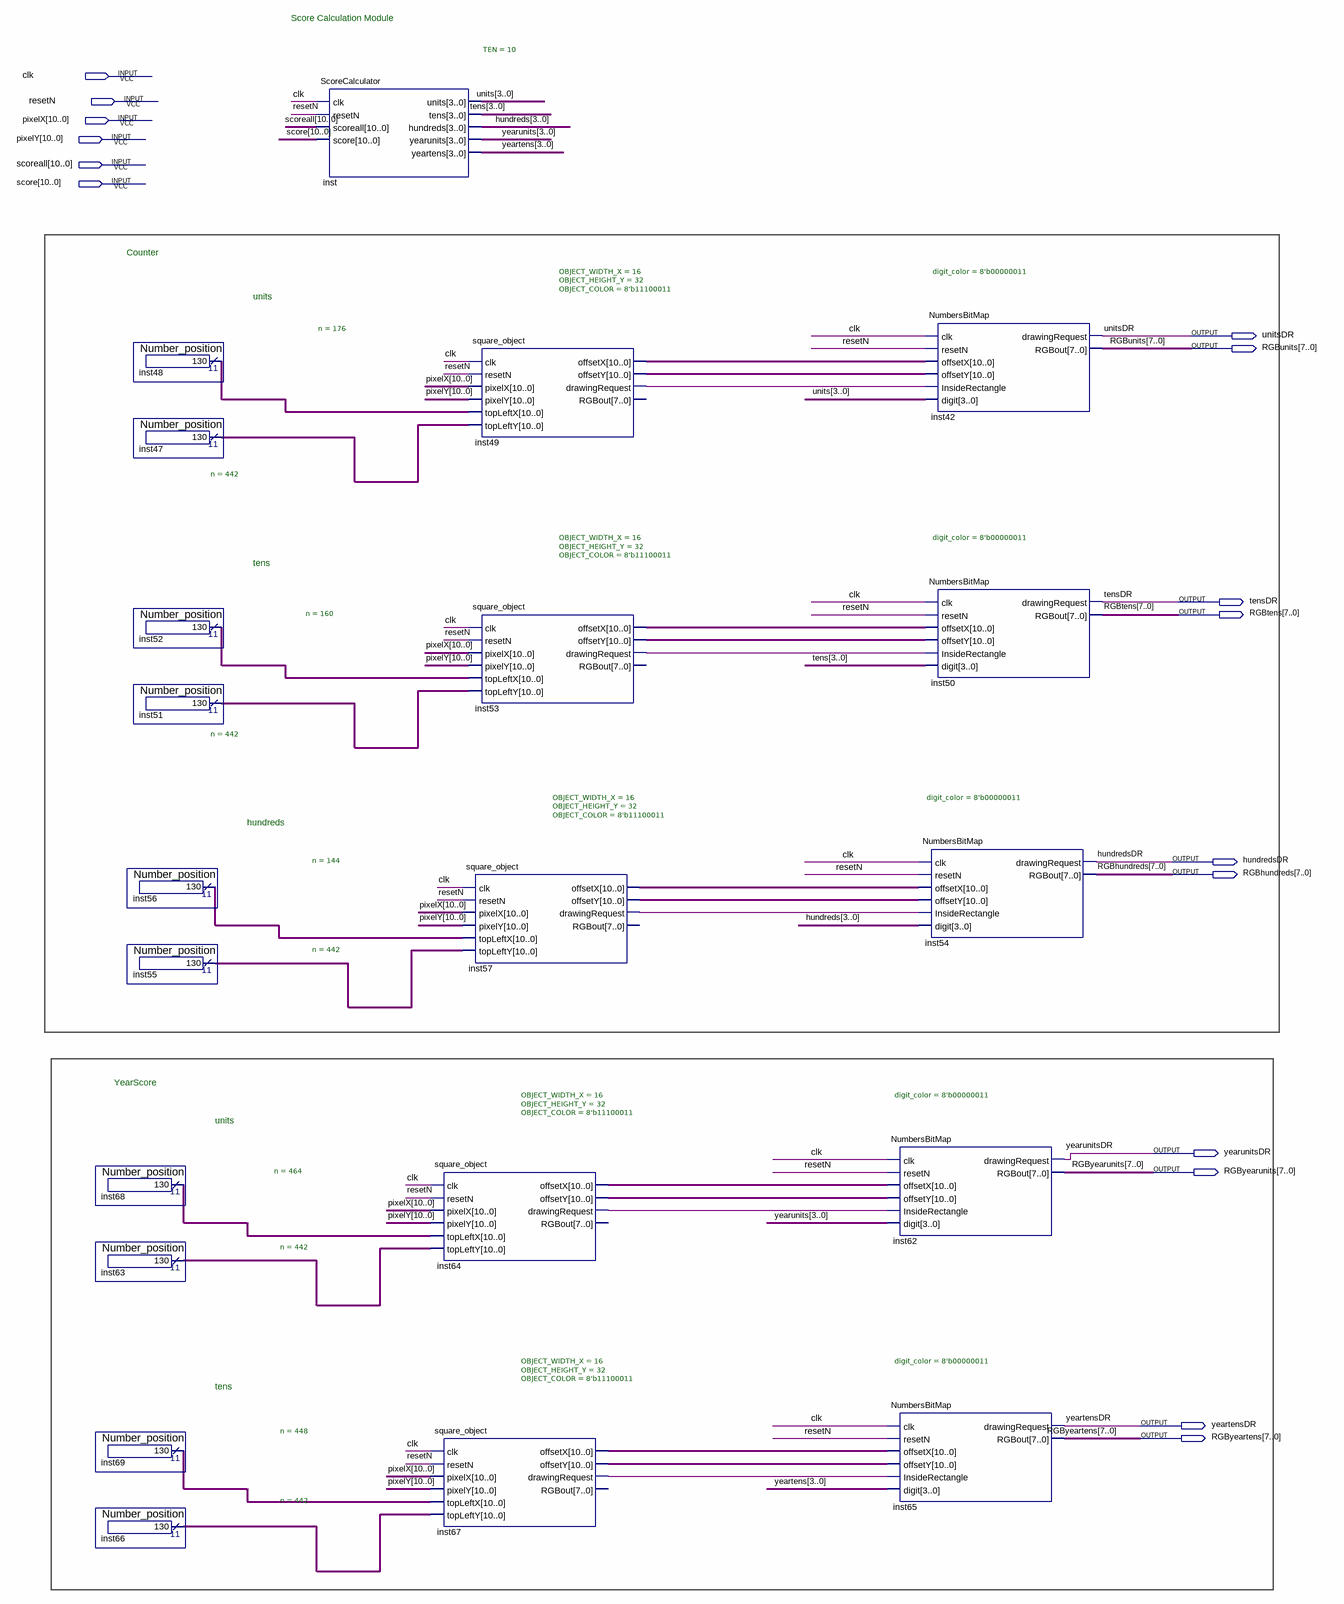
[diagram p0: schematic sheet]
// Quartus schematic Score_Block.bdf as structural Verilog: 21 symbols, 16 pins
module Score_Block (
  input  clk,
  input  resetN,
  input  [10:0] pixelX,
  input  [10:0] pixelY,
  input  [10:0] scoreall,
  input  [10:0] score,
  output unitsDR,
  output [7:0] RGBunits,
  output tensDR,
  output [7:0] RGBtens,
  output hundredsDR,
  output [7:0] RGBhundreds,
  output yearunitsDR,
  output [7:0] RGByearunits,
  output yeartensDR,
  output [7:0] RGByeartens
);

  wire inst49_drawingrequest, inst53_drawingrequest, inst57_drawingrequest, inst64_drawingrequest,
       inst67_drawingrequest;
  wire [3:0] hundreds, tens, units, yeartens, yearunits;
  wire [10:0] inst47_result, inst48_result, inst49_offsetx, inst49_offsety, inst51_result, inst52_result,
       inst53_offsetx, inst53_offsety, inst55_result, inst56_result, inst57_offsetx, inst57_offsety,
       inst63_result, inst64_offsetx, inst64_offsety, inst66_result, inst67_offsetx, inst67_offsety,
       inst68_result, inst69_result;

  Number_position #(.n(144)) inst56 (.result(inst56_result));
  Number_position #(.n(442)) inst55 (.result(inst55_result));
  Number_position #(.n(464)) inst68 (.result(inst68_result));
  Number_position #(.n(442)) inst63 (.result(inst63_result));
  Number_position #(.n(448)) inst69 (.result(inst69_result));
  Number_position #(.n(442)) inst66 (.result(inst66_result));
  Number_position #(.n(176)) inst48 (.result(inst48_result));
  Number_position #(.n(442)) inst47 (.result(inst47_result));
  Number_position #(.n(160)) inst52 (.result(inst52_result));
  Number_position #(.n(442)) inst51 (.result(inst51_result));
  ScoreCalculator #(.TEN(10)) inst (
    .clk(clk), .resetN(resetN), .scoreall(scoreall), .score(score), .units(units), .tens(tens),
    .hundreds(hundreds), .yearunits(yearunits), .yeartens(yeartens));
  square_object #(.OBJECT_WIDTH_X(16), .OBJECT_HEIGHT_Y(32), .OBJECT_COLOR(8'b11100011)) inst64 (
    .clk(clk), .resetN(resetN), .pixelX(pixelX), .pixelY(pixelY), .topLeftX(inst68_result),
    .topLeftY(inst63_result), .offsetX(inst64_offsetx), .offsetY(inst64_offsety),
    .drawingRequest(inst64_drawingrequest));  // open: RGBout
  square_object #(.OBJECT_WIDTH_X(16), .OBJECT_HEIGHT_Y(32), .OBJECT_COLOR(8'b11100011)) inst67 (
    .clk(clk), .resetN(resetN), .pixelX(pixelX), .pixelY(pixelY), .topLeftX(inst69_result),
    .topLeftY(inst66_result), .offsetX(inst67_offsetx), .offsetY(inst67_offsety),
    .drawingRequest(inst67_drawingrequest));  // open: RGBout
  square_object #(.OBJECT_WIDTH_X(16), .OBJECT_HEIGHT_Y(32), .OBJECT_COLOR(8'b11100011)) inst49 (
    .clk(clk), .resetN(resetN), .pixelX(pixelX), .pixelY(pixelY), .topLeftX(inst48_result),
    .topLeftY(inst47_result), .offsetX(inst49_offsetx), .offsetY(inst49_offsety),
    .drawingRequest(inst49_drawingrequest));  // open: RGBout
  square_object #(.OBJECT_WIDTH_X(16), .OBJECT_HEIGHT_Y(32), .OBJECT_COLOR(8'b11100011)) inst53 (
    .clk(clk), .resetN(resetN), .pixelX(pixelX), .pixelY(pixelY), .topLeftX(inst52_result),
    .topLeftY(inst51_result), .offsetX(inst53_offsetx), .offsetY(inst53_offsety),
    .drawingRequest(inst53_drawingrequest));  // open: RGBout
  square_object #(.OBJECT_WIDTH_X(16), .OBJECT_HEIGHT_Y(32), .OBJECT_COLOR(8'b11100011)) inst57 (
    .clk(clk), .resetN(resetN), .pixelX(pixelX), .pixelY(pixelY), .topLeftX(inst56_result),
    .topLeftY(inst55_result), .offsetX(inst57_offsetx), .offsetY(inst57_offsety),
    .drawingRequest(inst57_drawingrequest));  // open: RGBout
  NumbersBitMap #(.digit_color(8'b00000011)) inst62 (
    .clk(clk), .resetN(resetN), .offsetX(inst64_offsetx), .offsetY(inst64_offsety),
    .InsideRectangle(inst64_drawingrequest), .digit(yearunits), .drawingRequest(yearunitsDR),
    .RGBout(RGByearunits));
  NumbersBitMap #(.digit_color(8'b00000011)) inst65 (
    .clk(clk), .resetN(resetN), .offsetX(inst67_offsetx), .offsetY(inst67_offsety),
    .InsideRectangle(inst67_drawingrequest), .digit(yeartens), .drawingRequest(yeartensDR),
    .RGBout(RGByeartens));
  NumbersBitMap #(.digit_color(8'b00000011)) inst42 (
    .clk(clk), .resetN(resetN), .offsetX(inst49_offsetx), .offsetY(inst49_offsety),
    .InsideRectangle(inst49_drawingrequest), .digit(units), .drawingRequest(unitsDR), .RGBout(RGBunits));
  NumbersBitMap #(.digit_color(8'b00000011)) inst50 (
    .clk(clk), .resetN(resetN), .offsetX(inst53_offsetx), .offsetY(inst53_offsety),
    .InsideRectangle(inst53_drawingrequest), .digit(tens), .drawingRequest(tensDR), .RGBout(RGBtens));
  NumbersBitMap #(.digit_color(8'b00000011)) inst54 (
    .clk(clk), .resetN(resetN), .offsetX(inst57_offsetx), .offsetY(inst57_offsety),
    .InsideRectangle(inst57_drawingrequest), .digit(hundreds), .drawingRequest(hundredsDR),
    .RGBout(RGBhundreds));

  // Notes on the sheet:
  //   Score Calculation Module      
  //   Counter
  //   units
  //   tens
  //   hundreds
  //   YearScore
  //   units
  //   tens
endmodule
